# EAGLE design untitled (EAGLE 9.6.2)
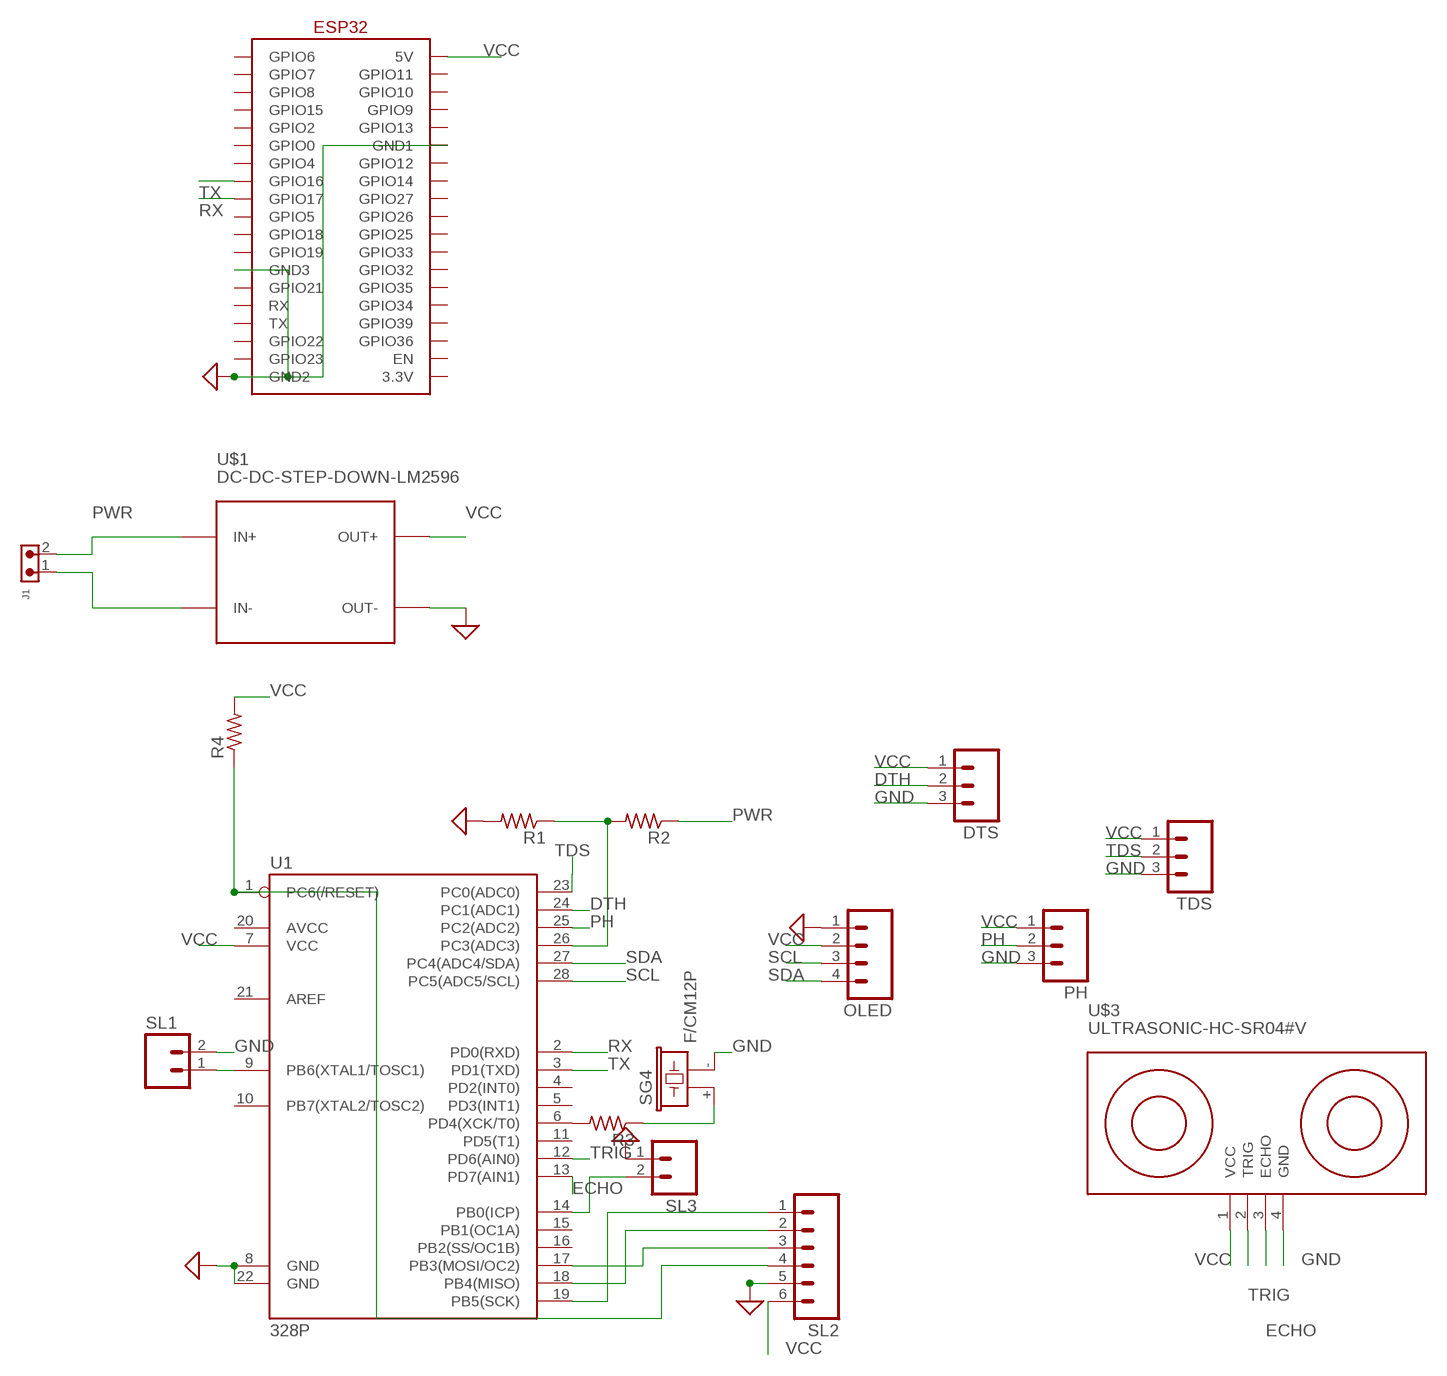
[diagram p0: schematic, sheet 1]

## Parts
DTS  M03  [03P]
J1  691305530002  [691305530002]
OLED  M04  [04P]
PH  M03  [03P]
R1  R-US_0207/10  [0207/10]
R2  R-US_0207/10  [0207/10]
R3  R-US_0204/2V  [0204V]
R4  R-US_0207/10  [0207/10]
SG4  F/CM12P  [F/CM12P]
SL1  M02  [02P]
SL2  M06  [06P]
SL3  M02  [02P]
TDS  M03  [03P]
U1  328P  ATMEGA328P_PDIP  [DIP28]
U$1  DC-DC-STEP-DOWN-LM2596  [DC-DC-STEP-DOWN-LM2596]
U$2  ESP32  [ESP32]
U$3  ULTRASONIC-HC-SR04#V  [ULTRASONIC-HC-SR04#V]

## Nets
DTH: DTS.2 U1.24(PC1(ADC1))
ECHO: U1.13(PD7(AIN1)) U$3.3(ECHO)
GND: DTS.3 OLED.1 PH.3 R1.2 SG4.- SL1.2 SL2.5 SL3.1 TDS.3 U1.8(GND) U1.22(GND) U$1.OUT- U$2.GND1 U$2.GND2 U$2.GND3 U$3.4(GND) ; supply symbol labelled SUP
N$1: R1.1 R2.2 U1.26(PC3(ADC3))
N$2: J1.1 U$1.IN-
N$3: SL3.2 U1.14(PB0(ICP))
N$4: SL2.1 U1.19(PB5(SCK))
N$5: SL2.2 U1.18(PB4(MISO))
N$6: SL2.3 U1.17(PB3(MOSI/OC2))
N$7: R4.1 SL2.4 U1.1(PC6(/RESET))
N$8: SL1.1 U1.9(PB6(XTAL1/TOSC1))
N$9: R3.2 U1.6(PD4(XCK/T0))
N$10: R3.1 SG4.+
PH: PH.2 U1.25(PC2(ADC2))
PWR: J1.2 R2.1 U$1.IN+
RX: U1.2(PD0(RXD)) U$2.GPIO17
SCL: OLED.3 U1.28(PC5(ADC5/SCL))
SDA: OLED.4 U1.27(PC4(ADC4/SDA))
TDS: TDS.2 U1.23(PC0(ADC0))
TRIG: U1.12(PD6(AIN0)) U$3.2(TRIG)
TX: U1.3(PD1(TXD)) U$2.GPIO16
VCC: DTS.1 OLED.2 PH.1 R4.2 SL2.6 TDS.1 U1.7(VCC) U$1.OUT+ U$2.5V U$3.1(VCC)
Unconnected: U1.4(PD2(INT0)) U1.5(PD3(INT1)) U1.10(PB7(XTAL2/TOSC2)) U1.11(PD5(T1)) U1.15(PB1(OC1A)) U1.16(PB2(SS/OC1B)) U1.20(AVCC) U1.21(AREF) U$2.3.3V U$2.EN U$2.GPIO0 U$2.GPIO2 U$2.GPIO4 U$2.GPIO5 U$2.GPIO6 U$2.GPIO7 U$2.GPIO8 U$2.GPIO9 U$2.GPIO10 U$2.GPIO11 U$2.GPIO12 U$2.GPIO13 U$2.GPIO14 U$2.GPIO15 U$2.GPIO18 U$2.GPIO19 U$2.GPIO21 U$2.GPIO22 U$2.GPIO23 U$2.GPIO25 U$2.GPIO26 U$2.GPIO27 U$2.GPIO32 U$2.GPIO33 U$2.GPIO34 U$2.GPIO35 U$2.GPIO36 U$2.GPIO39 U$2.RX U$2.TX

## Library data of the parts
DTS PH TDS = con-amp-quick:M03: AMP QUICK CONNECTOR; OC_FARNELL: unknown; OC_NEWARK: unknown
J1 = Wurth_Connectors_WR-TBL Pluggable Connector:691305530002: WR-TBL Serie 3055 - 5,08 mm - PCB Header Vertical Entry with Plastic Latches KIND PROPERTIES Pitch 5.08 mm MATERIAL PROPERTIES Insulator Material PA66 Insulator Flammability Rating UL94 V-0 Insulator Color Green Terminal Material Copper Alloy Terminal Plating Tin-plated surface GENERAL INFORMATION Operating Temperature -40 up to +105 °C ELECTRICAL PROPERTIES IR UL 16 A Working Voltage [UL] 300 V (AC) Withstanding Voltage [UL] 2500 V (AC) Contact Resistance [UL] 20 mΩ CERTIFICATION UL Approval E315414 <https://www.we-online.com/catalog/media/o135349v209%20Family_WR-TBL3_6913055300xx.jpg> Details see: https://www.we-online.com/catalog/en/TBL_5_08_3055_6913055300XX/ Updated by Ella Wu 2019-12-30 2019(C) Wurth Elektronik; DATASHEET-URL: https://www.we-online.com/catalog/datasheet/691305530002.pdf; IR-UL: 16A; MOUNT: THT; PART-NUMBER: 691305530002; PINS: 2; PITCH: 5.08mm; TYPE: Vertical; WORKING-VOLTAGE-UL: 300V (AC)
OLED = con-amp-quick:M04: AMP QUICK CONNECTOR; OC_FARNELL: unknown; OC_NEWARK: unknown
R1-R4 = BeagleBone_Black_Wireless:R-US_: RESISTOR, American symbol
SG4 = buzzer:F/CM12P: BUZZER Source: Buerklin; OC_FARNELL: unknown; OC_NEWARK: unknown
SL1 SL3 = con-amp-quick:M02: AMP QUICK CONNECTOR; OC_FARNELL: unknown; OC_NEWARK: unknown
SL2 = con-amp-quick:M06: AMP QUICK CONNECTOR; OC_FARNELL: unknown; OC_NEWARK: unknown
U1 = SparkFun-IC-Microcontroller:ATMEGA328P_PDIP: Atmel 328P Through hole ATMEGA328P uC used in the Arduino 32kb flash, 1k EEPROM, 2k SRAM Datasheet <http://www.sparkfun.com/datasheets/Components/SMD/ATMega328.pdf> SparkFun Products Storefront component: AVR 28 Pin 20MHz 32K 6A/D - ATMega328P <https://www.sparkfun.com/products/9061> (COM-09061) SparkFun Simon Says - Through-Hole Soldering Kit <https://www.sparkfun.com/products/10547> (KIT-10547) SparkFun Learn to Solder - Simon Says <https://www.sparkfun.com/products/13708> (KIT-13708) SparkFun BigTime Watch Kit <https://www.sparkfun.com/products/11734> (KIT-11734) SparkFun ClockIt <https://www.sparkfun.com/products/10930> (KIT-10930) SparkFun Serial Enabled LCD Kit <https://www.sparkfun.com/products/10097> (LCD-10097) SparkFun Simon Tilts - Through Hole Soldering Kit <https://www.sparkfun.com/products/12634> (KIT-12634) SparkFun Frequency Counter Kit <https://www.sparkfun.com/products/10140> (KIT-10140) FabFM Radio Kit <https://www.sparkfun.com/products/11043> (KIT-11043) SparkFun Binary Blaster Kit <https://www.sparkfun.com/products/12037> (KIT-12037) SparkFun Metro-Gnome <https://www.sparkfun.com/products/9236> (KIT-09236) ATmega328 with Arduino Optiboot (Uno) <https://www.sparkfun.com/products/10524> (DEV-10524); PROD_ID: IC-09136
U$1 = diy-modules:DC-DC-STEP-DOWN-LM2596: DC/DC Step-Down Regulator based on LM2596-ADJ chip LM2596 datasheet available here: http://www.ti.com/lit/ds/symlink/lm2596.pdf Click here to find device on ebay.com <http://www.ebay.com/sch/lm2596+power+regulator>
U$2 = ESP32:ESP32
U$3 = diy-modules:ULTRASONIC-HC-SR04: Ultrasonic Ranging Module HC-SR04 More details available here: http://randomnerdtutorials.com/complete-guide-for-ultrasonic-sensor-hc-sr04/ Click here to find device on ebay.com <http://www.ebay.com/sch/hc+sr04+ultrasonic>

## Board
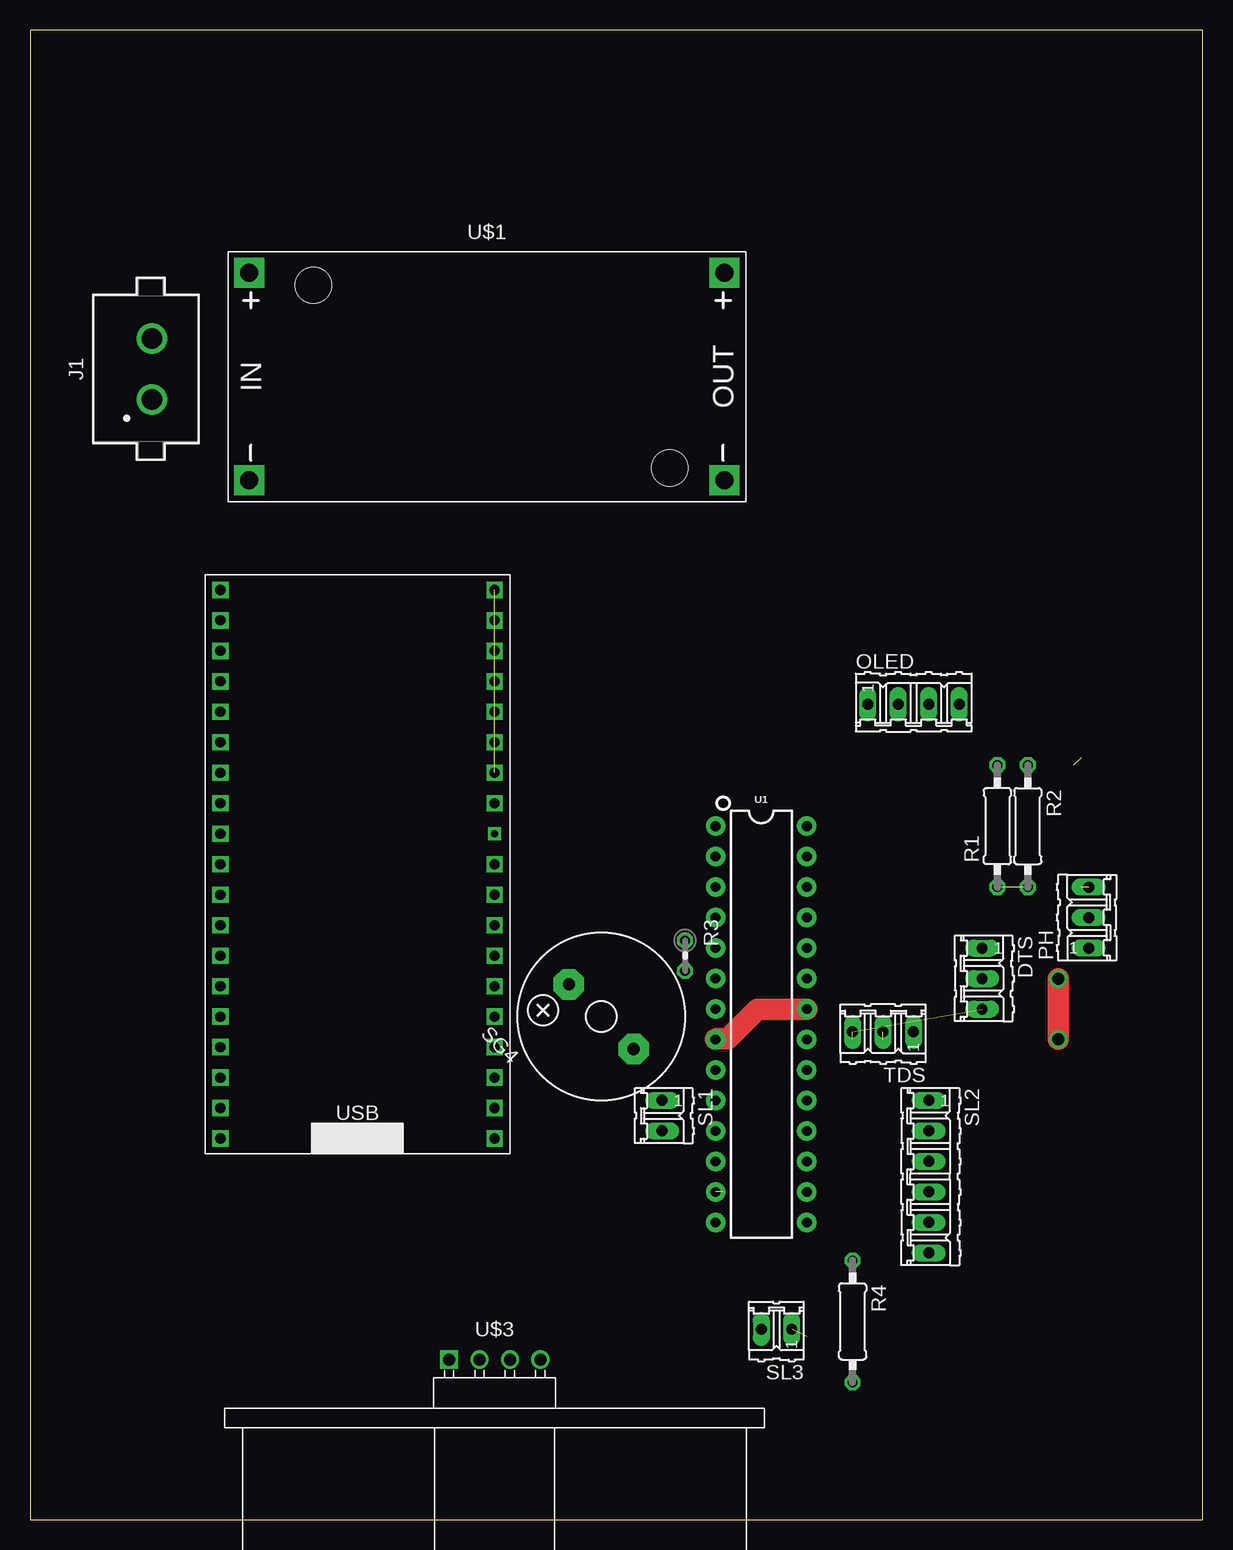
[diagram p1: board, top side]
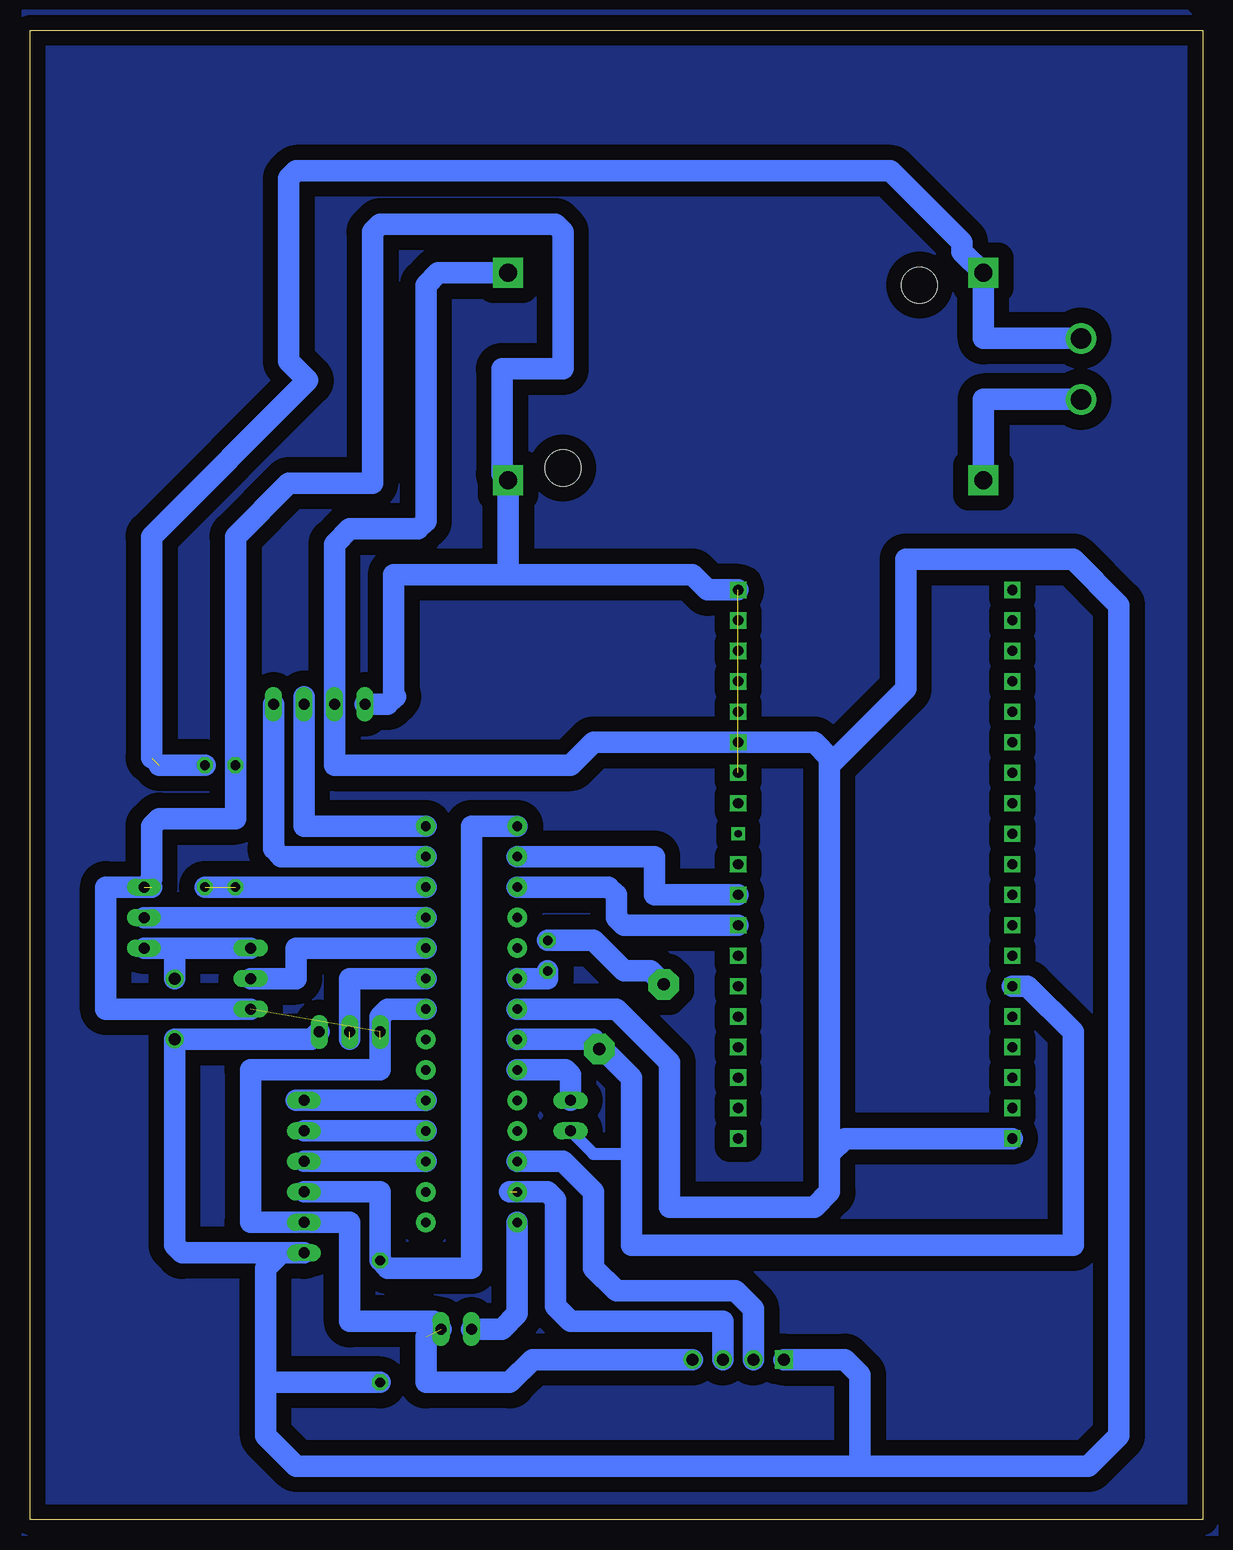
[diagram p2: board, bottom side, seen from below]

Size 97.77 x 124.13 mm. Coordinates in mm from the lower left corner, seen from the top.
Outline: 0,0 97.77,0 97.77,124.13 0,124.13 0,0
Copper layers (1*16): Top 0.035mm / dielectric 1.5mm / Bottom 0.035mm
Design rules "default *": minimum track width 6mil, minimum drill 0.35mm, track to track 30mil, track to pad 30mil, pad to pad 30mil, via to via 30mil, smd to smd 6mil, copper to edge 40mil, drill to drill 6mil, minimum pad ring 10mil, minimum via ring 8mil, stop-mask expansion 4mil, vias tented up to drill 0mil, thermal gap 10mil

### Footprints (pad centres in the part's own frame; a part is rotated, then mirrored left to right if it is on the bottom)
03P = drill 0.914 long: 1 -2.54,0; 2 0,0; 3 2.54,0
691305530002 = drill 1.7: 1 -2.54,0; 2 2.54,0
04P = drill 0.914 long: 1 -3.81,0; 2 -1.27,0; 3 1.27,0; 4 3.81,0
0207/10 = drill 0.813 octagon: 1 -5.08,0; 2 5.08,0
0204V = drill 0.813 octagon: 1 -1.27,0; 2 1.27,0
F/CM12P = drill 1.016 pad 2.54 octagon: + 3.81,0; - -3.81,0
02P = drill 0.914 long: 1 -1.27,0; 2 1.27,0
06P = drill 0.914 long: 1 -6.35,0; 2 -3.81,0; 3 -1.27,0; 4 1.27,0; 5 3.81,0; 6 6.35,0
DIP28 = drill 0.813 pad 1.626: 1 -16.51,-3.81; 2 -13.97,-3.81; 3 -11.43,-3.81; 4 -8.89,-3.81; 5 -6.35,-3.81; 6 -3.81,-3.81; 7 -1.27,-3.81; 8 1.27,-3.81; 9 3.81,-3.81; 10 6.35,-3.81; 11 8.89,-3.81; 12 11.43,-3.81; 13 13.97,-3.81; 14 16.51,-3.81; 15 16.51,3.81; 16 13.97,3.81; 17 11.43,3.81; 18 8.89,3.81; 19 6.35,3.81; 20 3.81,3.81; 21 1.27,3.81; 22 -1.27,3.81; 23 -3.81,3.81; 24 -6.35,3.81; 25 -8.89,3.81; 26 -11.43,3.81; 27 -13.97,3.81; 28 -16.51,3.81
DC-DC-STEP-DOWN-LM2596 = drill 1.5 pad 2.5 square: IN+ -19.812,8.636; IN- -19.812,-8.636; OUT+ 19.812,8.636; OUT- 19.812,-8.636 | hole 3: -14.478,7.62; 15.24,-7.62
ESP32 = drill 0.85 square: 3.3V 1.27,46.99; 5V 1.27,1.27; EN 1.27,44.45; GND1 1.27,13.97; GND2 24.13,46.99; GND3 24.13,31.75; GPIO0 24.13,13.97; GPIO2 24.13,11.43; GPIO4 24.13,16.51; GPIO5 24.13,24.13; GPIO6 24.13,1.27; GPIO7 24.13,3.81; GPIO8 24.13,6.35; GPIO9 1.27,8.89; GPIO10 1.27,6.35; GPIO11 1.27,3.81; GPIO12 1.27,16.51; GPIO13 1.27,11.43; GPIO14 1.27,19.05; GPIO15 24.13,8.89; GPIO16 24.13,19.05; GPIO17 24.13,21.59; GPIO19 24.13,29.21; GPIO21 24.13,34.29; GPIO22 24.13,41.91; GPIO23 24.13,44.45; GPIO25 1.27,26.67; GPIO26 1.27,24.13; GPIO27 1.27,21.59; GPIO32 1.27,31.75; GPIO33 1.27,29.21; GPIO34 1.27,36.83; GPIO35 1.27,34.29; GPIO36 1.27,41.91; GPIO39 1.27,39.37; RX 24.13,36.83; TX 24.13,39.37 | drill 0.6 square: GPIO18 24.13,26.67
ULTRASONIC-HC-SR04#V = drill 1 square: 1 -3.81,0 | drill 1: 2 -1.27,0; 3 1.27,0; 4 3.81,0

### Placement (x,y rotation side)
DTS  79.38,45.09 270 top
J1  10.16,95.89 90 top
OLED  73.66,67.94 0 top
PH  88.27,50.16 90 top
R1  80.64,57.79 90 top
R2  83.19,57.79 270 top
R3  54.61,46.99 270 top
R4  68.58,16.51 270 top
SG4  47.62,41.91 135 top
SL1  52.7,33.65 270 top
SL2  74.93,28.58 270 top
SL3  62.23,15.88 180 top
TDS  71.12,40.64 180 top
U1  60.96,41.27 270 top
U$1  38.1,95.25 0 top
U$2  14.61,30.48 0 top
U$3  38.73,13.34 0 top

### Tracks (layer width: path | path; a pad name or v marks a point on that pad's centre or on a via)
DTH
  Bottom 1.778: DTS.2 75.56,45.09 75.56,47.63 U1.24
ECHO  (1 unrouted)
  Bottom 1.778: U$3.3 40,16.51 52.7,16.51 53.97,17.78 53.97,26.67 54.61,27.3 57.78,27.3
GND  (5 unrouted)
  Top 1.778: U1.8 57.23,40.08 58.17,40.08 60.63,42.54 U1.22
  Bottom 1.016: 47.62,30.48 50.8,30.48 SL1.2
  Bottom 1.778: DTS.3 91.44,42.54 91.44,52.71 87.63,52.71 | U1.22 67.94,42.54 68.58,41.91 68.58,40.01 | PH.3 87.63,53.34 87.63,57.79 86.99,58.42 80.64,58.42 R1.2 80.64,81.91 76.2,86.36 69.22,86.36 69.22,107.31 68.58,107.95 53.97,107.95 53.34,107.31 53.34,95.89 58.42,95.89 58.42,87.12 U$1.OUT- 57.91,78.74 | OLED.1 67.94,67.94 67.31,68.58 67.44,68.71 67.44,78.74 57.91,78.74 | U$2.GND2 41.28,77.47 42.55,78.74 57.91,78.74 | U$2.GND1 14.61,44.45 10.79,40.64 10.79,22.86 47.62,22.86 47.62,30.48 47.62,36.83 50.16,39.37 | 50.16,39.37 50.8,40.01 U1.8 | TDS.3 68.58,37.46 79.38,37.46 79.38,24.77 SL2.5 71.12,24.77 71.12,16.51 64.13,16.51 SL3.1 | U$3.4 55.88,13.34 57.78,11.43 64.77,11.43 64.77,15.24 | SG4.- 50.16,39.37 | 50.16,39.37
N$1  (1 unrouted)
  Bottom 1.778: U1.26 R2.2
N$2
  Bottom 1.778: J1.1 18.29,93.34 U$1.IN-
N$3
  Bottom 1.778: U1.14 57.15,17.15 58.42,15.88 SL3.2
N$4
  Bottom 1.778: U1.19 SL2.1 75.56,34.93
N$5
  Bottom 1.778: U1.18 SL2.2
N$6
  Bottom 1.778: U1.17 SL2.3
N$7
  Bottom 1.778: U1.1 60.96,57.79 60.96,20.95 67.94,20.95 R4.1 68.58,25.4 68.58,27.3 SL2.4
N$8
  Bottom 1.778: U1.9 53.12,37.46 52.7,37.05 SL1.1
N$9
  Bottom 1.778: U1.6 54.61,45.09 R3.2
N$10
  Bottom 1.778: SG4.+ 46.05,45.72 48.26,45.72 50.8,48.26 R3.1
N$11
  pour Bottom (isolate 1.27): 0,124.46 1.27,125.73 98.42,125.73 98.42,-1.27 -1.27,-1.27 -1.27,123.19
PH
  Bottom 1.778: PH.2 U1.25
PWR  (1 unrouted)
  Bottom 1.778: R2.1 86.99,62.87 | J1.2 18.29,98.43 U$1.IN+ 20.07,105.66 20.07,106.43 26.04,112.4 75.56,112.4 76.2,111.76 76.2,96.52 74.61,94.93 87.63,81.91 87.63,63.5
RX
  Bottom 1.778: U$2.GPIO17 45.72,52.07 45.72,55.24 U1.2
SCL
  Bottom 1.778: U1.28 74.93,57.79 OLED.3 74.93,68.58
SDA
  Bottom 1.778: OLED.4 77.47,55.88 76.83,55.24 U1.27
TDS  (1 unrouted)
  Bottom 1.778: U1.23 71.12,45.09 71.12,40.01
TRIG
  Bottom 1.778: U1.12 53.34,29.85 50.8,27.3 50.8,20.95 48.89,19.05 38.95,19.05 37.47,17.56 U$3.2
TX
  Bottom 1.778: U$2.GPIO16 48.26,49.53 48.89,50.16 48.89,52.07 49.53,52.71 U1.3
VCC  (via drill 1)
  Top 1.778: v85.72,40.01 v85.72,45.09
  Bottom 1.778: DTS.1 85.72,47.63 | 85.72,47.63 PH.1 | TDS.1 74.3,40.01 v85.72,40.01 85.72,22.86 85.09,22.23 76.83,22.23 | v85.72,45.09 85.72,47.63 | U1.7 48.89,42.54 44.45,38.1 44.45,26.04 32.39,26.04 31.11,27.3 31.11,30.48 | U$2.5V 29.85,31.75 31.11,30.48 | 31.11,30.48 31.11,62.87 | 31.11,62.87 31.11,63.5 32.39,64.77 50.8,64.77 52.7,62.87 72.39,62.87 OLED.2 72.39,81.28 71.12,82.55 65.41,82.55 64.77,83.19 64.77,102.87 63.75,103.89 U$1.OUT+ | 31.11,62.87 24.76,69.22 24.76,80.01 10.79,80.01 6.98,76.2 6.98,6.98 9.52,4.45 28.57,4.45 | 78.1,11.43 78.1,6.98 75.56,4.45 28.57,4.45 | 78.1,11.43 78.1,20.95 76.83,22.23 | SL2.6 76.83,22.23 | R4.2 78.1,11.43 | U$3.1 29.85,13.34 28.57,12.06 28.57,4.45